# Altium schematic sheet ch32v003f4p6.SchDoc
size A
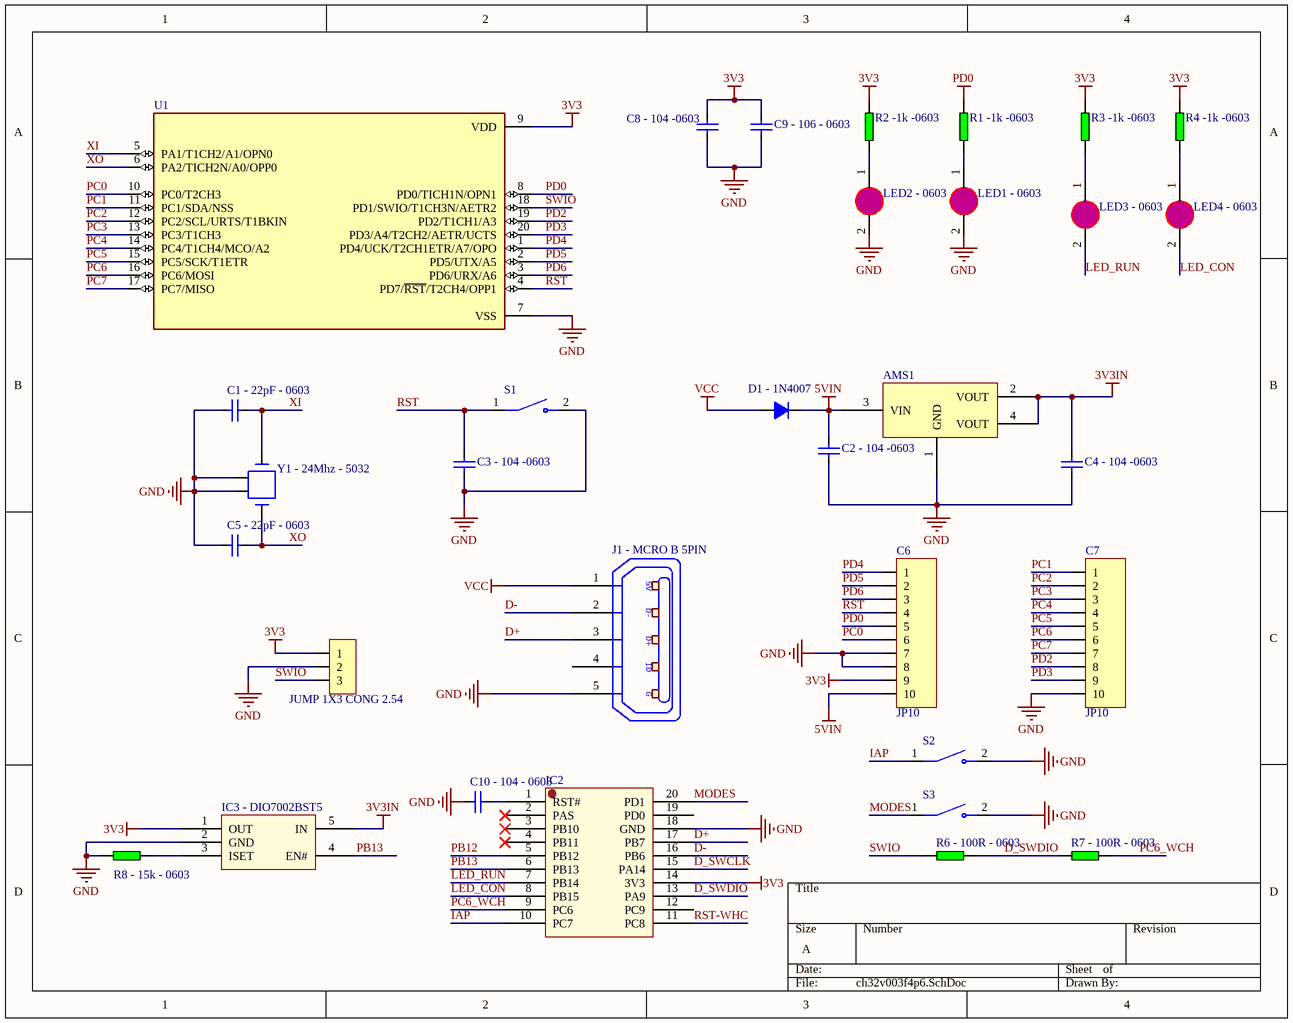
[diagram p0: ch32v003f4p6.SchDoc]

## Parts
AMS1  https://item.taobao.com/item.htm?spm=a21n57.1.item.1.2d59523c0jL9r3&priceTId=2100cffb17222652112301059e0daa&utparam=%7B%22aplus_abtest%22:%228d6c448640fdb3c53b807733b28a5cb2%22%7D&id=38606140029&xxc=ad_ztc&skuId=4863406686169  [SOT223]  (value not drawn)
C1_-_22pF_-_0603  https://item.taobao.com/item.htm?spm=a21n57.1.item.1.761d6d89425Xau&priceTId=215042e617222676571722239ef4ef&utparam=%7B%22aplus_abtest%22:%22c1189c4a14198e2dacf5e9844fe58682%22%7D&id=647178308487&xxc=ad_ztc&sku_properties=1627207:33152859807  [CAP_0603]  (value not drawn)
C2_-_104_-0603  https://detail.tmall.com/item.htm?spm=a21n57.1.item.2.e39479c3zi28Ro&priceTId=215042e617222674570567215ef4ef&utparam=%7B%22aplus_abtest%22:%22f832d35a4eeebe82529f3980fa58ca81%22%7D&id=597768869888&ns=1&abbucket=18&xxc=taobaoSearch&skuId=4330994678086  [CAP_0603]  (value not drawn)
C3_-_104_-0603  https://detail.tmall.com/item.htm?spm=a21n57.1.item.2.e39479c3zi28Ro&priceTId=215042e617222674570567215ef4ef&utparam=%7B%22aplus_abtest%22:%22f832d35a4eeebe82529f3980fa58ca81%22%7D&id=597768869888&ns=1&abbucket=18&xxc=taobaoSearch&skuId=4330994678086  [CAP_0603]  (value not drawn)
C4_-_104_-0603  https://detail.tmall.com/item.htm?spm=a21n57.1.item.2.e39479c3zi28Ro&priceTId=215042e617222674570567215ef4ef&utparam=%7B%22aplus_abtest%22:%22f832d35a4eeebe82529f3980fa58ca81%22%7D&id=597768869888&ns=1&abbucket=18&xxc=taobaoSearch&skuId=4330994678086  [CAP_0603]  (value not drawn)
C5_-_22pF_-_0603  https://item.taobao.com/item.htm?spm=a21n57.1.item.1.761d6d89425Xau&priceTId=215042e617222676571722239ef4ef&utparam=%7B%22aplus_abtest%22:%22c1189c4a14198e2dacf5e9844fe58682%22%7D&id=647178308487&xxc=ad_ztc&sku_properties=1627207:33152859807  [CAP_0603]  (value not drawn)
C6  JP10  [JP10-D1T]
C7  JP10  [JP10-D1T]
C8_-_104_-0603  https://detail.tmall.com/item.htm?spm=a21n57.1.item.2.e39479c3zi28Ro&priceTId=215042e617222674570567215ef4ef&utparam=%7B%22aplus_abtest%22:%22f832d35a4eeebe82529f3980fa58ca81%22%7D&id=597768869888&ns=1&abbucket=18&xxc=taobaoSearch&skuId=4330994678086  [CAP_0603]  (value not drawn)
C9_-_106_-_0603  https://detail.tmall.com/item.htm?spm=a21n57.1.item.2.e39479c3zi28Ro&priceTId=215042e617222674570567215ef4ef&utparam=%7B%22aplus_abtest%22:%22f832d35a4eeebe82529f3980fa58ca81%22%7D&id=597768869888&ns=1&abbucket=18&xxc=taobaoSearch&skuId=4330994678105  [CAP_0603]  (value not drawn)
C10_-_104_-_0603  https://detail.tmall.com/item.htm?spm=a21n57.1.item.2.e39479c3zi28Ro&priceTId=215042e617222674570567215ef4ef&utparam=%7B%22aplus_abtest%22:%22f832d35a4eeebe82529f3980fa58ca81%22%7D&id=597768869888&ns=1&abbucket=18&xxc=taobaoSearch&skuId=4330994678086  [CAP_0603]  (value not drawn)
D1_-_1N4007  https://detail.tmall.com/item.htm?spm=a21n57.1.item.2.1972523cpK2SUS&priceTId=2100cffb17223519704247964e0db5&utparam=%7B%22aplus_abtest%22:%2238829314758e2ee9b94a75e5e465b18c%22%7D&id=622491401377&ns=1&abbucket=18&xxc=taobaoSearch&pisk=fDdn9o_1CpWQOnz-xCfIesWevKDOAk15d3FR2_IrQGS_9TS-d3Xk2h6y96Lpjg-vqadpwQv_ZETW921-R6TCN_oxDjCkRe1S62WXdBVa7ZTaL7Szxe5Q8_oxDb2T79idaLLZB6IGQG_lzgSe418NkZCz8M-PbO7Vkk5Pa38ZSa7zLkSFaO8NoaheGvSBaCRZYOfhCm1WYCbhQjLFbFTiywWndeIaamRG-os28GVzaMMtlpLMJDVXW6O9mZKK_WxD8K-y3hlgtO9eSQXXNkuNaTJ9H9viY7j99aXVaO4zaFfFftOOgjrG5d8pUBt3r77B9IBlcO0zNTCwMtJ2xzgX767yVtO-cWsezEOXHscu_6XP4fya3tqTNNuJ_8w5LN_Gcx3dEGPIxNG-SV2qP971Ri3iS8w5LN_GDV0g3b6F5wsA.&skuId=4399809072526  [DIO-214AC(SMA)]  (value not drawn)
IC2  https://item.taobao.com/item.htm?spm=a21n57.1.item.4.7928523cbcyAuc&priceTId=2100c80317222666507678122e0bd7&utparam=%7B%22aplus_abtest%22:%22730e09ae68ceed0df009b4d1744c6b49%22%7D&id=739482526160&ns=1&abbucket=18  [TSSOP-20]  (value not drawn)
IC3_-_DIO7002BST5  https://item.taobao.com/item.htm?spm=a21n57.1.item.2.7626523cfVaOFv&priceTId=213e379717223518499405157e1c14&utparam=%7B%22aplus_abtest%22:%2205f50d6a6ae0e4a53d8c6118e04135ae%22%7D&id=819639225820&ns=1&abbucket=18&pisk=fdHnOFZ_1XPBdxsJ-A2Bw-yUnLRORww7O4B8y8Uy_Pz1p7zJO4VoyVNrpJnKSzuxruHKeYc1EmiSpHwJAJiQF88vkKeoADwShyClsvqwQuma4ayP-DyCY88vkLfObWTLUbnw62Vg_PZu4zzEzNSacPrUzTuz75r4DwyzU4owjurzYMzUa5ra0jTvTyMrQA8UsRsqSWOmCkV3r6UGEuHNHWa2dPWReyq_t6nUSTWrIft9p-UeGGU7pyi7x49fdJPoT2qaELXaK2iEU5DJWKFn0uu7pA-PTrlKJRkEigWrjJ4UwvNC-F4qdckbQ5p2mcksJDMi2gJzXqUZAvyk3nw3LyygfYL1LzcZavFQFw83UcqP4G5NgSbOFl--Q_17TlZglIKLZPWB-l9Jjhf2VWr_ArKMj_17TlZgkhxGgLNUfkaA.&skuId=5693680879200  [SOT23-5]  (value not drawn)
J1_-_MCRO_B_5PIN  https://item.taobao.com/item.htm?spm=a21n57.1.item.5.73eb520dLWBjYf&priceTId=2150446517223521105158004e1c99&utparam=%7B%22aplus_abtest%22:%221c9f2b3a0f28d69b363b670c8463923d%22%7D&id=586030971920&xxc=ad_ztc&pisk=fhTotmffc3SWZqFKEEbSvNWPrdoxV8_CVpUdpwBE0tWbyMWKVpjHpKseyadJn9J9K6LJJexb-COByb_KNaO5RwktBVQHNQ_Ch31D-ebV01CnJzzU8YdPJ7MtBV3n4S7nEAKp0AnVn6XVa67U8j2VN67FT_7Eit5h1kyyLwlDgt1CTJWFYorVw1ZEG1oPFe82uYScPBghq8JPZgX32TUHBEaO4OlN3y4hEMSk2QW08y8Dcj3RWTo_M9_RFB1kdVa5zMxyEs7n-r7kFQ8FmeHxWgANTp_JuXrPQ3pRuU-gTyRcrTSpPgwonO8WgF_VDVlMgE9JNEALT25vBtRWzw0Z1abPUZfXJxaPKn-eyg_QUYbei6SrborNj-UCgXL4AksPGsXsXbIh3zMlG2hmillC4s15Bjc0AksPGsXtijqZRg5fNOC..  [USB-M1]  (value not drawn)
JP1  JUMP 1X3 CONG 2.54  [JP 1x3 DC]
LED1_-_0603  https://item.taobao.com/item.htm?spm=a21n57.1.item.3.6d41523cxJIaep&priceTId=215042e617222674510636877ef4ef&utparam=%7B%22aplus_abtest%22:%22727870f63769223130f50a7597dafb2c%22%7D&id=522573309525&ns=1&abbucket=18  [CAP_0402]  (value not drawn)
LED2_-_0603  https://item.taobao.com/item.htm?spm=a21n57.1.item.3.6d41523cxJIaep&priceTId=215042e617222674510636877ef4ef&utparam=%7B%22aplus_abtest%22:%22727870f63769223130f50a7597dafb2c%22%7D&id=522573309525&ns=1&abbucket=18  [CAP_0402]  (value not drawn)
LED3_-_0603  https://item.taobao.com/item.htm?spm=a21n57.1.item.3.6d41523cxJIaep&priceTId=215042e617222674510636877ef4ef&utparam=%7B%22aplus_abtest%22:%22727870f63769223130f50a7597dafb2c%22%7D&id=522573309525&ns=1&abbucket=18  [CAP_0402]  (value not drawn)
LED4_-_0603  https://item.taobao.com/item.htm?spm=a21n57.1.item.3.6d41523cxJIaep&priceTId=215042e617222674510636877ef4ef&utparam=%7B%22aplus_abtest%22:%22727870f63769223130f50a7597dafb2c%22%7D&id=522573309525&ns=1&abbucket=18  [CAP_0402]  (value not drawn)
R1_-1k_-0603  https://item.taobao.com/item.htm?spm=a21n57.1.item.11.2f164856Ly1wEH&priceTId=2100c80417222672745194921e0d6a&utparam=%7B%22aplus_abtest%22:%221457bc8fc52b973fa757549749ed2a16%22%7D&id=714447261374&ns=1&abbucket=18&skuId=5455679591657  [RES-SMD-0603]  (value not drawn)
R2_-1k_-0603  https://item.taobao.com/item.htm?spm=a21n57.1.item.11.2f164856Ly1wEH&priceTId=2100c80417222672745194921e0d6a&utparam=%7B%22aplus_abtest%22:%221457bc8fc52b973fa757549749ed2a16%22%7D&id=714447261374&ns=1&abbucket=18&skuId=5455679591657  [RES-SMD-0603]  (value not drawn)
R3_-1k_-0603  https://item.taobao.com/item.htm?spm=a21n57.1.item.11.2f164856Ly1wEH&priceTId=2100c80417222672745194921e0d6a&utparam=%7B%22aplus_abtest%22:%221457bc8fc52b973fa757549749ed2a16%22%7D&id=714447261374&ns=1&abbucket=18&skuId=5455679591657  [RES-SMD-0603]  (value not drawn)
R4_-1k_-0603  https://item.taobao.com/item.htm?spm=a21n57.1.item.11.2f164856Ly1wEH&priceTId=2100c80417222672745194921e0d6a&utparam=%7B%22aplus_abtest%22:%221457bc8fc52b973fa757549749ed2a16%22%7D&id=714447261374&ns=1&abbucket=18&skuId=5455679591657  [RES-SMD-0603]  (value not drawn)
R6_-_100R_-_0603  https://item.taobao.com/item.htm?spm=a21n57.1.item.3.7a42663bk1jn76&priceTId=2147bf4817222679395476498ee04b&utparam=%7B%22aplus_abtest%22:%221ee322dd99466e0366035d8e5a8b8514%22%7D&id=560031619629&ns=1&abbucket=18  [RES-SMD-0603]  (value not drawn)
R7_-_100R_-_0603  https://item.taobao.com/item.htm?spm=a21n57.1.item.3.7a42663bk1jn76&priceTId=2147bf4817222679395476498ee04b&utparam=%7B%22aplus_abtest%22:%221ee322dd99466e0366035d8e5a8b8514%22%7D&id=560031619629&ns=1&abbucket=18  [RES-SMD-0603]  (value not drawn)
R8_-_15k_-_0603  https://item.taobao.com/item.htm?spm=a21n57.1.item.2.1c7168224D2imW&priceTId=2147bf9317223528886347338e1bef&utparam=%7B%22aplus_abtest%22:%22214ace5614ea73923ae9b43c558a513d%22%7D&id=522575222746&ns=1&abbucket=18&pisk=fZl-9XtBdnxlvwvnN490tzz7JlL0pb3yq0u1tkqldmnxRofHz7vU9DExYu2uNufL92nExD3ezyZIADEnEKAiz4PUOhqpsC0rmEyfD0U7dSTQ7PQWwIvDP4PUOHQcOdAtzcK-ebK8dEFbJyUQOTNCGEU38MNQVJsfhPZbAWNIArNbJyZCOz67cZGbSaEhPkCKdbF3VF_l46CKMrTzD4Ihtrh4yCEtyoK6XjCaelg7D6tGqdoavol6mK3qmYiuuDd9DSgsH7a-AC6gcx3jaRV9CTnso0lTNfKRZr2L2xG7Hw1IlSruKvnJ2TrSEmeal-_p_rmgc4lSHeSjPcq8NrwD1F3bdxczQbxfw5MZr7DIcIC-fgytsfI0xGqT-TTvk9WUFr2gZW57f4ekUrEMotXFL-44klYvk9WUFrzYjEAcL9y0u  [RES-SMD-0603]  (value not drawn)
S1  https://item.taobao.com/item.htm?spm=a21n57.1.item.1.7a27523cWOPxnM&priceTId=2100c80317222666042388981e0bd7&utparam=%7B%22aplus_abtest%22%3A%22f4310c709b45f5dccbb5f48f2f1eb2e5%22%7D&id=812035768909&ns=1&abbucket=18#detail&xxc=taobaoSearch  [SW_B3U-1000P]  (value not drawn)
S2  https://item.taobao.com/item.htm?spm=a21n57.1.item.1.7a27523cWOPxnM&priceTId=2100c80317222666042388981e0bd7&utparam=%7B%22aplus_abtest%22%3A%22f4310c709b45f5dccbb5f48f2f1eb2e5%22%7D&id=812035768909&ns=1&abbucket=18#detail&xxc=taobaoSearch  [SW_B3U-1000P]  (value not drawn)
S3  https://item.taobao.com/item.htm?spm=a21n57.1.item.1.7a27523cWOPxnM&priceTId=2100c80317222666042388981e0bd7&utparam=%7B%22aplus_abtest%22%3A%22f4310c709b45f5dccbb5f48f2f1eb2e5%22%7D&id=812035768909&ns=1&abbucket=18#detail&xxc=taobaoSearch  [SW_B3U-1000P]  (value not drawn)
U1  https://item.taobao.com/item.htm?spm=a21n57.1.item.4.72ed523cBBafEt&priceTId=213e37cc17222663960674536e10f0&utparam=%7B%22aplus_abtest%22:%22d40f99ef09f9644e6c58f1d655571507%22%7D&id=798714965876&ns=1&abbucket=18&skuId=5611113778034  [SOP65P640X121-20N]  (value not drawn)
Y1_-_24Mhz_-_5032  https://item.taobao.com/item.htm?spm=a21n57.1.item.4.110b18c7vZzasz&priceTId=2147810f17222664944182893eef8e&utparam=%7B%22aplus_abtest%22:%22d6f2bd80d93d6f7d95da589080f7e049%22%7D&id=815314876162&ns=1&abbucket=18&skuId=5681394335315  [Crystal 4 pin SMD 50x32]  (value not drawn)

## Nets
3V3: C6.9 C8_-_104_-0603.2 C9_-_106_-_0603.2 IC2.14(3V3) IC3_-_DIO7002BST5.1(OUT) JP1.1 R2_-1k_-0603.2 R3_-1k_-0603.2 R4_-1k_-0603.2 U1.9(VDD)
3V3IN: AMS1.2(VOUT) AMS1.4(VOUT) C4_-_104_-0603.2 IC3_-_DIO7002BST5.5(IN)
5VIN: AMS1.3(VIN) C2_-_104_-0603.2 C6.10 D1_-_1N4007.2(K)
GND: AMS1.1(GND) C1_-_22pF_-_0603.1 C2_-_104_-0603.1 C3_-_104_-0603.1 C4_-_104_-0603.1 C5_-_22pF_-_0603.1 C6.7 C6.8 C7.10 C8_-_104_-0603.1 C9_-_106_-_0603.1 C10_-_104_-_0603.1 IC2.18(GND) IC3_-_DIO7002BST5.2(GND) J1_-_MCRO_B_5PIN.5(P5) JP1.2 LED1_-_0603.2(K) LED2_-_0603.2(K) R8_-_15k_-_0603.2 S1.2 S2.2 S3.2 U1.7(VSS) Y1_-_24Mhz_-_5032.2(GND) Y1_-_24Mhz_-_5032.4(GND)
PD0: C6.5 R1_-1k_-0603.2 U1.8(PD0/TICH1N/OPN1)
VCC: D1_-_1N4007.1(A) J1_-_MCRO_B_5PIN.1(P1)
D+: IC2.17(PB7) J1_-_MCRO_B_5PIN.3(P3)
D-: IC2.16(PB6) J1_-_MCRO_B_5PIN.2(P2)
D_SWCLK: IC2.15(PA14)
D_SWDIO: IC2.13(PA9) R6_-_100R_-_0603.1 R7_-_100R_-_0603.1
IAP: IC2.10(PC7) S2.1
LED_CON: IC2.8(PB15) LED4_-_0603.2(K)
LED_RUN: IC2.7(PB14) LED3_-_0603.2(K)
MODES: IC2.20(PD1) S3.1
PB12: IC2.5(PB12)
PB13: IC2.6(PB13) IC3_-_DIO7002BST5.4(EN#)
PC0: C6.6 U1.10(PC0/T2CH3)
PC1: C7.1 U1.11(PC1/SDA/NSS)
PC2: C7.2 U1.12(PC2/SCL/URTS/T1BKIN)
PC3: C7.3 U1.13(PC3/T1CH3)
PC4: C7.4 U1.14(PC4/T1CH4/MCO/A2)
PC5: C7.5 U1.15(PC5/SCK/T1ETR)
PC6: C7.6 U1.16(PC6/MOSI)
PC6_WCH: IC2.9(PC6) R7_-_100R_-_0603.2
PC7: C7.7 U1.17(PC7/MISO)
PD2: C7.8 U1.19(PD2/T1CH1/A3)
PD3: C7.9 U1.20(PD3/A4/T2CH2/AETR/UCTS)
PD4: C6.1 U1.1(PD4/UCK/T2CH1ETR/A7/OPO)
PD5: C6.2 U1.2(PD5/UTX/A5)
PD6: C6.3 U1.3(PD6/URX/A6)
RST: C3_-_104_-0603.2 C6.4 S1.1 U1.4(PD7/~{RST}/T2CH4/OPP1)
RST-WHC: IC2.11(PC8)
SWIO: JP1.3 R6_-_100R_-_0603.2 U1.18(PD1/SWIO/T1CH3N/AETR2)
XI: C1_-_22pF_-_0603.2 U1.5(PA1/T1CH2/A1/OPN0) Y1_-_24Mhz_-_5032.1(OSC1)
XO: C5_-_22pF_-_0603.2 U1.6(PA2/TICH2N/A0/OPP0) Y1_-_24Mhz_-_5032.3(OSC2)
NetC10_-_104_-_0603_2: C10_-_104_-_0603.2 IC2.1(RST#)
NetIC3_-_DIO7002BST5_3: IC3_-_DIO7002BST5.3(ISET) R8_-_15k_-_0603.1
NetLED1_-_0603_1: LED1_-_0603.1(A) R1_-1k_-0603.1
NetLED2_-_0603_1: LED2_-_0603.1(A) R2_-1k_-0603.1
NetLED3_-_0603_1: LED3_-_0603.1(A) R3_-1k_-0603.1
NetLED4_-_0603_1: LED4_-_0603.1(A) R4_-1k_-0603.1

Not connected (* = marked no-connect by the designer): IC2 2(PAS)* 3(PB10)* 4(PB11)* 12(PC9) 19(PD0); J1_-_MCRO_B_5PIN 4(P4)

## Notes on the sheet
- (in symbol USB-5) 5V; D-; D+; ID; G

## Library data of the parts
AMS1 = AMS1117 SMD: Dán; Value: AMS1117-3.3V SOT223; Don_Vi: Con; Ma_Hang: MH000596; Ghi_Chu: *; Kieu_Chan: *; Chung_Loai: Dán
C1_-_22pF_-_0603 C2_-_104_-0603 C3_-_104_-0603 C4_-_104_-0603 C5_-_22pF_-_0603 C8_-_104_-0603 C9_-_106_-_0603 C10_-_104_-_0603 = CapSMD: Capacitor; Value: 33p; Published: 8-Jun-2000; LatestRevisionDate: 17-Jul-2002; LatestRevisionNote: Re-released for DXP Platform.; PackageReference: RAD-0.3; Publisher: Altium Limited
C6 C7 = JP10: WR-PHD 2.54 mm Angled Socket Header; Manufacturer: W¨¹rth Elektronik eiSos GmbH; partNo: 613010143121; ComponentLink1 Description: Manufacturer; ComponentLink2 Description: Datasheet; NoPins: 10; Created Date: 29 March 2013; ComponentLink1URL: http://www.we-online.com; ComponentLink2URL: http://katalog.we-online.de/em/datasheet/6130xx143121.pdf; Created by: Karrer Zheng
D1_-_1N4007 = D1A: Diode 1A; Value: 1N4007
IC2 = CH32V305FBP6
IC3_-_DIO7002BST5 = DIO7002BST5 SMD
J1_-_MCRO_B_5PIN = USB-5: Manufacturer: FCI; Manufacturer Part Number: 10118193-0001LF; Connector Type: USB - micro B; Number of Contacts: 5; Gender: Receptacle; Specifications: USB 2.0; .Creator: MM; .Checked PCB: RF; Supplier 1: Digi-Key; RoHS: RoHS Compliant; Category: Connectors, Interconnects; Stock 1: 28642; Pricing 1: 1=0.46, 10=0.433, 25=0.3712, 50=0.3156, 100=0.3032, 250=0.27224, 500=0.25988 (USD); Packaging: Cut Tape (CT); Mounting Type: Surface Mount, Right Angle, Horizontal; Features: Shielded, Solder Retention; Ingress Protection: -; ComponentLink1URL: http://portal.fciconnect.com/Comergent//fci/drawing/10118193.pdf; ComponentLink1Description: http://portal.fciconnect.com/Comergent//fci/drawing/10118193.pdf; Supplier Part Number 1: 609-4616-1-ND; .Checked SCH: MM
JP1 = JP 1x3 2.54 Duc Cong: Cắm; Ten_Linh_Kien: Jump Đơn Đực 2.54MM 1x40P Cong Đứng; Don_Vi: Con; Ma_Hang: MH000904; Ghi_Chu: *; Kieu_Chan: *; Chung_Loai: Cắm
LED1_-_0603 LED2_-_0603 LED3_-_0603 LED4_-_0603 = LED0805: LED SMD 0805
R1_-1k_-0603 R2_-1k_-0603 R3_-1k_-0603 R4_-1k_-0603 R6_-_100R_-_0603 R7_-_100R_-_0603 R8_-_15k_-_0603 = RES: Resistor 1/4W; Value: R1/4W - 1K
S1-S3 = B3U-1000P: Switch Tactile N.O. SPST Round Button Gull Wing 0.05A 12VDC 1.5N SMD Embossed T/R; Price: None; MP: B3U-1000P; Availability: Unavailable; Value: *; Package: None
U1 = CH32V003F4P6: Industrial-grade general-purpose microcontroller; MF: WCH; SnapEDA_Link: https://www.snapeda.com/parts/CH32V003F4P6/WCH/view-part/?ref=snap; Package: Package; Value: *; MP: CH32V003F4P6; Check_prices: https://www.snapeda.com/parts/CH32V003F4P6/WCH/view-part/?ref=eda
Y1_-_24Mhz_-_5032 = XTAL_4Pin SMD: Crystal Oscillator; Published: 8-Jun-2000; LatestRevisionDate: 17-Jul-2002; LatestRevisionNote: Re-released for DXP Platform.; PackageReference: R38; Publisher: Altium Limited